# Altium schematic sheet 03.Template.MCU-sub.Power.Clock.Debug.SchDoc
size 209 x 297 mm; PartName: Микроконтроллер. Подсхема ПТО; Author: Мурашкин Д.В.; DocumentNumber: _D01.R1; SheetNumber: 1; SheetTotal: 4; Scale: 1:1; Letter1Column: Э; DocumentsNumber: _D01.R1
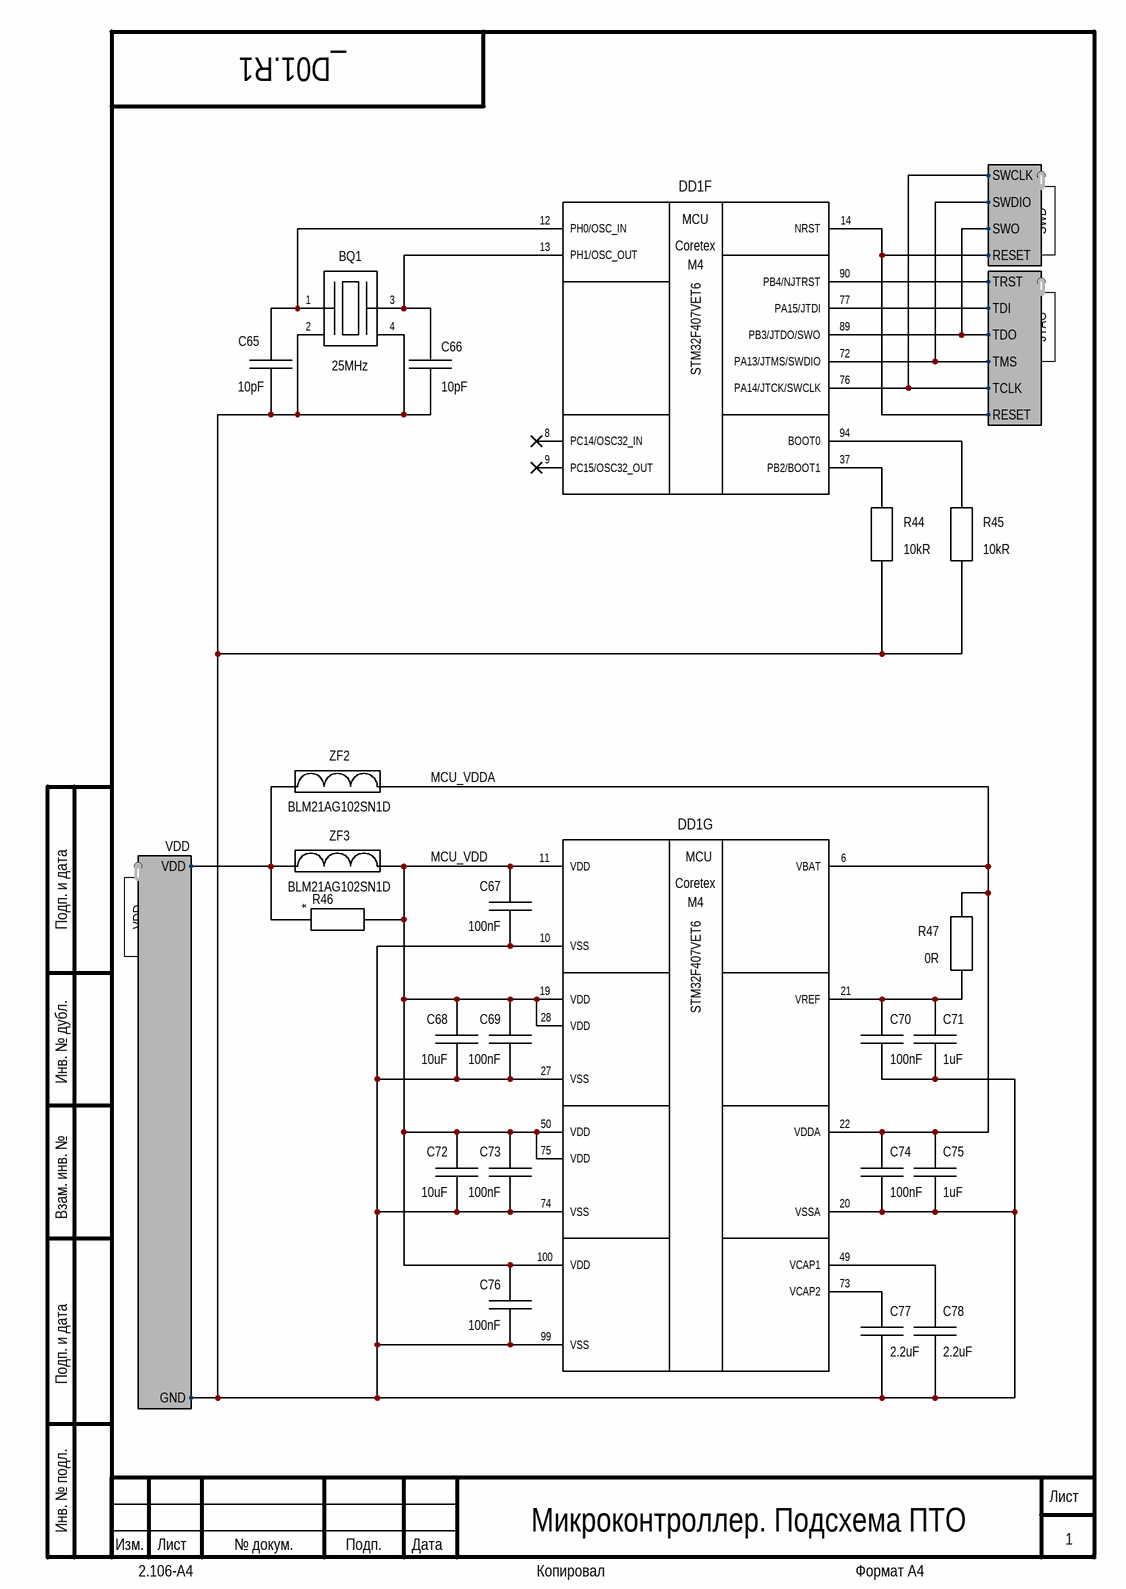
[diagram p0: 03.Template.MCU-sub.Power.Clock.Debug.SchDoc]

## Parts
BQ1  25MHz  [CRYST3225-4N]
C65  10pF  [CAPC2012N]
C66  10pF  [CAPC2012N]
C67  100nF  [CAPC2012N]
C68  10uF  [CAPC2012N]
C69  100nF  [CAPC2012N]
C70  100nF  [CAPC2012N]
C71  1uF  [CAPC2012N]
C72  10uF  [CAPC2012N]
C73  100nF  [CAPC2012N]
C74  100nF  [CAPC2012N]
C75  1uF  [CAPC2012N]
C76  100nF  [CAPC2012N]
C77  2.2uF  [CAPC2012N]
C78  2.2uF  [CAPC2012N]
DD1  STM32F407VET6  [LQFP-100N]  (parts F,G of 7)
R44  10kR  [RESC2012N]
R45  10kR  [RESC2012N]
R46  (no value)  [RESC2012N-NM]  (no BOM)
R47  0R  [RESC2012N]
ZF2  BLM21AG102SN1D  [FERB2012N]
ZF3  BLM21AG102SN1D  [FERB2012N]

## Ports
JTAG (harness JTAG), SWD (harness SWD), VDD (harness VDD)

## Harnesses
VDD: VDD, GND
JTAG: TMS, TDO, TDI, TRST, TCLK, RESET
SWD: SWCLK, SWO, SWDIO, RESET

## Nets
MCU_VDD: C67.1 C68.1 C69.1 C72.1 C73.1 C76.1 DD1.11(VDD) DD1.19(VDD) DD1.28(VDD) DD1.50(VDD) DD1.75(VDD) DD1.100(VDD) R46.2 ZF3.2
MCU_VDDA: C74.1 C75.1 DD1.6(VBAT) DD1.22(VDDA) R47.1 ZF2.2
NetBQ1_1: BQ1.1 C65.1 DD1.12(PH0/OSC_IN)
NetBQ1_2: BQ1.2 BQ1.4 C65.2 C66.2 C67.2 C68.2 C69.2 C70.2 C71.2 C72.2 C73.2 C74.2 C75.2 C76.2 C77.2 C78.2 DD1.10(VSS) DD1.20(VSSA) DD1.27(VSS) DD1.74(VSS) DD1.99(VSS) R44.2 R45.2 ; port VDD.GND
NetBQ1_3: BQ1.3 C66.1 DD1.13(PH1/OSC_OUT)
NetC70_1: C70.1 C71.1 DD1.21(VREF) R47.2
NetC77_1: C77.1 DD1.73(VCAP2)
NetC78_1: C78.1 DD1.49(VCAP1)
NetDD1_14: DD1.14(NRST) ; port JTAG.RESET, port SWD.RESET
NetDD1_37: DD1.37(PB2/BOOT1) R44.1
NetDD1_72: DD1.72(PA13/JTMS/SWDIO) ; port JTAG.TMS, port SWD.SWDIO
NetDD1_76: DD1.76(PA14/JTCK/SWCLK) ; port JTAG.TCLK, port SWD.SWCLK
NetDD1_77: DD1.77(PA15/JTDI) ; port JTAG.TDI
NetDD1_89: DD1.89(PB3/JTDO/SWO) ; port JTAG.TDO, port SWD.SWO
NetDD1_90: DD1.90(PB4/NJTRST) ; port JTAG.TRST
NetDD1_94: DD1.94(BOOT0) R45.1
NetR46_1: R46.1 ZF2.1 ZF3.1 ; port VDD.VDD

Not connected (* = marked no-connect by the designer): DD1 8(PC14/OSC32_IN)* 9(PC15/OSC32_OUT)*

## Notes on the sheet
- Подп. и дата
- Инв. № дубл.
- Взам. инв. №
- Инв. № подл.
- Изм.
- Лист
- № докум.
- Подп.
- Дата
- 2.106-A4
- Копировал
- Формат А4
- (in symbol STM32F407VET6, part F) MCU; Coretex; M4
- (in symbol STM32F407VET6, part G) MCU; Coretex; M4

## Library data of the parts
BQ1 = X322525MMB4SI: Crystal 25MHz 10pF; Manufacturer: YXC; Group: Discrete; ESR: 50kOhm; Frequency tolerance: ±10ppm; Component: Oscillators; Part name: X322525MMB4SI; Package: 3225; Frequency: 25MHz; Height: 0.75mm; Operating temperature: -40°C +85°C; Load capacitance: 10pF; Mounting type: Surface mount; Dimension: 3.20mm x 2.50mm; Item ID: X322525MMB4SI; Operating temperature Min: -40°C; Operating temperature Max: +85°C; Width: 5.2mm; Length: 2.5mm; Supplier 1: LCSC; Supplier Part Number 1: C70582; Datasheet URL: https://datasheet.lcsc.com/lcsc/2304140030_YXC-X322525MMB4SI_C70582.pdf; Category: Crystal; Value: 25MHz
C65 C66 = 0805CG100J500NT: Capacitor Ceramic 10pF 50V C0G 2012; Manufacturer: FH; Tolerance: ±5%; Group: Discrete; Component: Capacitors; Value: 10pF/50V; Value code: 100; Item ID: 0805CG100J500NT; Part name: 0805CG100J500NT; Package: 2012; Capacitance: 10pF; Voltage: 50V; Dielectric: C0G; Technology: Multi layer; Operating temperature Min: -55°C; Operating temperature Max: +125°C; Width: 1.25mm; Length: 2.0mm; Height: 0.55mm; Mounting type: Surface mount; Supplier 1: LCSC; Supplier Part Number 1: C157608; Datasheet URL: https://datasheet.lcsc.com/lcsc/2304140030_FH--Guangdong-Fenghua-Advanced-Tech-0805CG100J500NT_C157608.pdf?_gl=1*1oyk1cl*_ga*MTk2MTgyMTQ2NS4xNzA5MTMzOTYz*_ga_98M84MKSZH*MTcwOTE0MzQwMS4yLjEuMTcwOTE0NjgyMy42MC4wLjA.; Category: Ceramic
C67 C69 C70 C73 C74 C76 = 0805B104K500NT: Capacitor Ceramic 100nF 50V X7R 2012; Manufacturer: FH; Tolerance: ±10%; Group: Discrete; Component: Capacitors; Value: 100nF/50V; Value code: 104; Item ID: 0805B104K500NT; Part name: 0805B104K500NT; Package: 2012; Capacitance: 100nF; Voltage: 50V; Dielectric: X7R; Technology: Multi layer; Operating temperature Min: -55°C; Operating temperature Max: +125°C; Width: 1.25mm; Length: 2.0mm; Height: 0.8mm; Mounting type: Surface mount; Supplier 1: LCSC; Supplier Part Number 1: C38141; Datasheet URL: https://datasheet.lcsc.com/lcsc/2304140030_FH--Guangdong-Fenghua-Advanced-Tech-0805B103K500NT_C52278.pdf?_gl=1*18q9nu3*_ga*MTk2MTgyMTQ2NS4xNzA5MTMzOTYz*_ga_98M84MKSZH*MTcwOTE0MzQwMS4yLjEuMTcwOTE0NzM5MC43LjAuMA..; Category: Ceramic
C68 C72 = GRM21BR61H106KE43L: Capacitor Ceramic 10uF 50V X5R 2012; Manufacturer: Murata Electronics; Tolerance: ±10%; Group: Discrete; Component: Capacitors; Value: 10uF/50V; Value code: 106; Item ID: GRM21BR61H106KE43L; Part name: GRM21BR61H106KE43L; Package: 2012; Capacitance: 10uF; Voltage: 50V; Dielectric: X5R; Technology: Multi layer; Operating temperature Min: -55°C; Operating temperature Max: +85°C; Width: 1.25mm; Length: 2.0mm; Height: 1.25mm; Mounting type: Surface mount; Supplier 1: LCSC; Supplier Part Number 1: C440198; Datasheet URL: https://datasheet.lcsc.com/lcsc/2310251059_Murata-Electronics-GRM21BR61H106KE43L_C440198.pdf?_gl=1*1lxpbko*_ga*MTk2MTgyMTQ2NS4xNzA5MTMzOTYz*_ga_98M84MKSZH*MTcwOTE0MzQwMS4yLjEuMTcwOTE0NzE1NS42MC4wLjA.; Category: Ceramic
C71 C75 = 0805B105K500NT: Capacitor Ceramic 1uF 50V X7R 2012; Manufacturer: FH; Tolerance: ±10%; Group: Discrete; Component: Capacitors; Value: 1uF/50V; Value code: 105; Item ID: 0805B105K500NT; Part name: 0805B105K500NT; Package: 2012; Capacitance: 1uF; Voltage: 50V; Dielectric: X7R; Technology: Multi layer; Operating temperature Min: -55°C; Operating temperature Max: +125°C; Width: 1.25mm; Length: 2.0mm; Height: 0.8mm; Mounting type: Surface mount; Supplier 1: LCSC; Supplier Part Number 1: C215803; Datasheet URL: https://datasheet.lcsc.com/lcsc/2304140030_FH--Guangdong-Fenghua-Advanced-Tech-0805B103K500NT_C52278.pdf?_gl=1*18q9nu3*_ga*MTk2MTgyMTQ2NS4xNzA5MTMzOTYz*_ga_98M84MKSZH*MTcwOTE0MzQwMS4yLjEuMTcwOTE0NzM5MC43LjAuMA..; Category: Ceramic
C77 C78 = 0805X225K500NT: Capacitor Ceramic 2.2uF 50V X5R 2012; Manufacturer: FH; Tolerance: ±15%; Group: Discrete; Component: Capacitors; Value: 2.2uF/50V; Value code: 225; Item ID: 0805X225K500NT; Part name: 0805X225K500NT; Package: 2012; Capacitance: 2.2uF; Voltage: 50V; Dielectric: X5R; Technology: Multi layer; Operating temperature Min: -55°C; Operating temperature Max: +85°C; Width: 1.25mm; Length: 2.0mm; Height: 0.8mm; Mounting type: Surface mount; Supplier 1: LCSC; Supplier Part Number 1: C108719; Datasheet URL: https://datasheet.lcsc.com/lcsc/2304140030_FH--Guangdong-Fenghua-Advanced-Tech-0805X225K500NT_C108719.pdf?_gl=1*1vi7l0*_ga*MTk2MTgyMTQ2NS4xNzA5MTMzOTYz*_ga_98M84MKSZH*MTcwOTE0MzQwMS4yLjEuMTcwOTE0NzU5NC42MC4wLjA.; Category: Ceramic
DD1 = STM32F407VET6: Microcontroller STM32F4 32b 168MHz 512kB Cortex-M4 LQFP-100; Manufacturer: STMicroelectronics; Core count: 1; SRAM: 192kB; Peripherals: BOD, WDT, PWM, RTC, ADC, DAC, DMA, LCD; Interfaces: GPIO, UART, SPI, JTAG, I2C, I2S, USB, CAN, LIN, DCMI, EBI/EMI, IrDA, Ethernet; Operating voltage Min: 1.8V; Operating voltage Max: 3.6V; Group: Digital; Item ID: STM32F407VET6; Part name: STM32F407VET6; Package: LQFP-100; Core: Cortex-M4; Core frequency Max: 168MHz; FLASH: 512kB; Operating temperature Min: -40°C; Operating temperature Max: +85°C; Width: 16.0mm; Length: 16.0mm; Height: 1.6mm; Mounting type: Surface mount; Supplier 1: LCSC; Supplier Part Number 1: C28730; Datasheet URL: https://www.st.com/resource/en/datasheet/stm32f407vg.pdf; Component URL: https://www.st.com/en/microcontrollers-microprocessors/stm32f407ve.html; Component: Microcontrollers; Category: STM32
R44 R45 = 0805W8F1002T5E: Resistor Ceramic 10kR 1% 2012; Manufacturer: UNI-ROYAL; Power: 125mW; Temperature coefficient: ±100ppm; Group: Discrete; Component: Resistors; Value code: 1002; Item ID: 0805W8F1002T5E; Part name: 0805W8F1002T5E; Package: 2012; Resistance: 10kR; Tolerance: ±1%; Technology: Thin film; Operating temperature Min: -55°C; Operating temperature Max: +125°C; Width: 1.25mm; Length: 2.0mm; Height: 0.55mm; Mounting type: Surface mount; Supplier 1: LCSC; Supplier Part Number 1: C17414; Datasheet URL: https://datasheet.lcsc.com/lcsc/2206010216_UNI-ROYAL-Uniroyal-Elec-0805W8F1912T5E_C17508.pdf?_gl=1*13rsoe6*_ga*MTk2MTgyMTQ2NS4xNzA5MTMzOTYz*_ga_98M84MKSZH*MTcwOTE1NjkxMy4zLjEuMTcwOTE1OTk5Ni41NS4wLjA.; Category: Ceramic; Value: 10kR
R46 = RESC NM 2012: Part name: RESC2012_NM; Mounting type: Not mount; Group: Discrete; Component: Resistors; Item ID: RESC NM 2012; Package: 2012; Width: 2.0mm; Length: 1.25mm; Height: 0.55mm; Category: Ceramic
R47 = 0805W8F0000T5E: Resistor Ceramic 0R 1% 2012; Manufacturer: UNI-ROYAL; Power: 125mW; Temperature coefficient: ±100ppm; Group: Discrete; Component: Resistors; Value code: 0; Item ID: 0805W8F0000T5E; Part name: 0805W8F0000T5E; Package: 2012; Resistance: 0R; Tolerance: ±1%; Technology: Thin film; Operating temperature Min: -55°C; Operating temperature Max: +125°C; Width: 1.25mm; Length: 2.0mm; Height: 0.55mm; Mounting type: Surface mount; Supplier 1: LCSC; Supplier Part Number 1: C17477; Datasheet URL: https://datasheet.lcsc.com/lcsc/2206010216_UNI-ROYAL-Uniroyal-Elec-0805W8F0000T5E_C17477.pdf?_gl=1*s59qgl*_ga*MTk2MTgyMTQ2NS4xNzA5MTMzOTYz*_ga_98M84MKSZH*MTcwOTE1NjkxMy4zLjEuMTcwOTE1ODA5Mi42MC4wLjA.; Category: Ceramic; Value: 0R
ZF2 ZF3 = BLM21AG102SN1D: Ferrite Bead 0.6A 1k/100MHz 2012; Manufacturer: Murata Electronics; DC resistance: 280mOhm; Group: Discrete; Component: Filters; Impedance resistance: 1kOhm; Impedance frequency: 100MHz; Item ID: BLM21AG102SN1D; Part name: BLM21AG102SN1D; Package: 2012; Current rated: 0.6A; Operating temperature Min: -55°C; Operating temperature Max: +125°C; Width: 1.2mm; Length: 2.0mm; Height: 1.05mm; Mounting type: Surface mount; Supplier 1: LCSC; Supplier Part Number 1: C85835; Datasheet URL: https://www.murata.com/en-us/products/en-us/products/productdata/8796738977822/ENFA0005.pdf; Component URL: https://www.murata.com/en-global/products/productdetail?partno=BLM21AG102SN1%23; Category: Beads; Value: 0.6A